# Altium schematic sheet DDR3 Memory Module One.SchDoc: DDR3L Module (1/2)
size A4; DrawnBy: Chris Segiet; Revision: v1.0.0
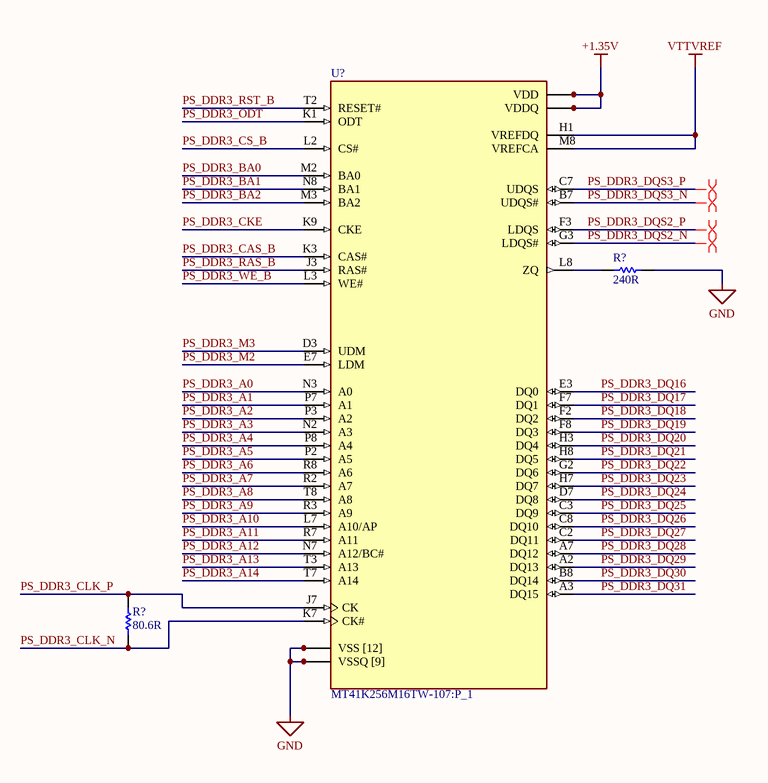
[diagram p0: DDR3 Memory Module One.SchDoc]

## Parts
(Parts that share a designator on the sheet are numbered #1, #2 ... from top to bottom, then left to right.)
R?#1  240R  [RESC1005X40X25NL05T05]
R?#2  80.6R  [RESC1005X40X25NL05T05]
U?  MT41K256M16TW-107:P_1  [BGA96C80P9X16_1400X800X120]

## Nets
+1.35V: U?.A1(VDDQ) U?.A8(VDDQ) U?.B2(VDD) U?.C1(VDDQ) U?.C9(VDDQ) U?.D2(VDDQ) U?.D9(VDD) U?.E9(VDDQ) U?.F1(VDDQ) U?.G7(VDD) U?.H2(VDDQ) U?.H9(VDDQ) U?.K2(VDD) U?.K8(VDD) U?.N1(VDD) U?.N9(VDD) U?.R1(VDD) U?.R9(VDD)
GND: R?#1.2 U?.A9(VSS_[12]) U?.B1(VSSQ) U?.B3(VSS) U?.B9(VSSQ) U?.D1(VSSQ) U?.D8(VSSQ) U?.E1(VSS) U?.E2(VSSQ) U?.E8(VSSQ) U?.F9(VSSQ) U?.G1(VSSQ) U?.G8(VSS) U?.G9(VSSQ_[9]) U?.J2(VSS) U?.J8(VSS) U?.M1(VSS) U?.M9(VSS) U?.P1(VSS) U?.P9(VSS) U?.T1(VSS) U?.T9(VSS)
VTTVREF: U?.H1(VREFDQ) U?.M8(VREFCA)
PS_DDR3_A0: U?.N3(A0)
PS_DDR3_A1: U?.P7(A1)
PS_DDR3_A2: U?.P3(A2)
PS_DDR3_A3: U?.N2(A3)
PS_DDR3_A4: U?.P8(A4)
PS_DDR3_A5: U?.P2(A5)
PS_DDR3_A6: U?.R8(A6)
PS_DDR3_A7: U?.R2(A7)
PS_DDR3_A8: U?.T8(A8)
PS_DDR3_A9: U?.R3(A9)
PS_DDR3_A10: U?.L7(A10/AP)
PS_DDR3_A11: U?.R7(A11)
PS_DDR3_A12: U?.N7(A12/BC#)
PS_DDR3_A13: U?.T3(A13)
PS_DDR3_A14: U?.T7(A14)
PS_DDR3_BA0: U?.M2(BA0)
PS_DDR3_BA1: U?.N8(BA1)
PS_DDR3_BA2: U?.M3(BA2)
PS_DDR3_CAS_B: U?.K3(CAS#)
PS_DDR3_CKE: U?.K9(CKE)
PS_DDR3_CLK_N: R?#2.2 U?.K7(CK#)
PS_DDR3_CLK_P: R?#2.1 U?.J7(CK)
PS_DDR3_CS_B: U?.L2(CS#)
PS_DDR3_DQ16: U?.E3(DQ0)
PS_DDR3_DQ17: U?.F7(DQ1)
PS_DDR3_DQ18: U?.F2(DQ2)
PS_DDR3_DQ19: U?.F8(DQ3)
PS_DDR3_DQ20: U?.H3(DQ4)
PS_DDR3_DQ21: U?.H8(DQ5)
PS_DDR3_DQ22: U?.G2(DQ6)
PS_DDR3_DQ23: U?.H7(DQ7)
PS_DDR3_DQ24: U?.D7(DQ8)
PS_DDR3_DQ25: U?.C3(DQ9)
PS_DDR3_DQ26: U?.C8(DQ10)
PS_DDR3_DQ27: U?.C2(DQ11)
PS_DDR3_DQ28: U?.A7(DQ12)
PS_DDR3_DQ29: U?.A2(DQ13)
PS_DDR3_DQ30: U?.B8(DQ14)
PS_DDR3_DQ31: U?.A3(DQ15)
PS_DDR3_DQS2_N: U?.G3(LDQS#)
PS_DDR3_DQS2_P: U?.F3(LDQS)
PS_DDR3_DQS3_N: U?.B7(UDQS#)
PS_DDR3_DQS3_P: U?.C7(UDQS)
PS_DDR3_M2: U?.E7(LDM)
PS_DDR3_M3: U?.D3(UDM)
PS_DDR3_ODT: U?.K1(ODT)
PS_DDR3_RAS_B: U?.J3(RAS#)
PS_DDR3_RST_B: U?.T2(RESET#)
PS_DDR3_WE_B: U?.L3(WE#)
NetR?#1_1: R?#1.1 U?.L8(ZQ)

## Layout directives
differential pair: PS_DDR3_DQS2_N, PS_DDR3_DQS2_P, PS_DDR3_DQS3_N, PS_DDR3_DQS3_P

## Notes on the sheet
- Title
- Size:
- Date:
- A3
- Drawn by:
- Time:
- Revision:
- Sheet
- of
- File:

## Library data of the parts
R?#1 = CMP-2002-00493-3: Resistor - 240 Ohm, +/- 5%, 100 mW, 0402; PartNumber: ERJ-2GEJ241x; Manufacturer: Basic Passives; Resistance: 240 Ohm; Voltage Rating: 50 V; Case\/Package: 0402; Power Rating: 100 mW; PackageReference: 0402; ComponentLink1URL: http://www.panasonic.com/; ComponentLink2Description: Datasheet; PackageDescription: 2-Pin Surface Mount Device, Body 1 x 0.5 mm; Tolerance: 5%; Radiation Hardening: No; Packaging: Tape and Reel; Case Code (Metric): 1005; Case Code (Imperial): 0402; Mount: Surface Mount; REACH SVHC: Yes; Length: 1 mm; Mounting Technology: Surface Mount; Max Operating Temperature: 155 degC; Height: 0.35 mm; Width: 0.5 mm; Package Quantity: 10000; RoHSCompliant: true; DatasheetVersion: 03/2015; Pins: 2; ComponentLink1Description: Manufacturer URL; Min Operating Temperature: -55 degC; ComponentLink2URL: http://industrial.panasonic.com/cdbs/www-data/pdf/RDA0000/AOA0000C84.pdf
R?#2 = CMP-2002-01076-1: Resistor - 80.6R 1% 0.1W 0402; Manufacturer: Panasonic; Part Number: ERJ-2RKF80R6X; Resistance: 80.6; Category: Resistor; Tolerance: 1%; Power Rating: 0.1W; Case Code (Imperial): 0402
U? = MT41K256M16TW-107:P_1: Memory - DDR3L Memory IC 4Gb (256M x 16) Parallel 933MHz 20ns 96-FBGA (8x14); MF: {'manufacturer': u'Micron Technology Inc.'}; Price: None; Value: *; Package: None; Availability: Unavailable; MP: MT41K256M16TW-107:P; Category: Memory